# Altium schematic sheet TEMPLATE_Connectors.SchDoc
size Tabloid; SheetNumber: 3; SheetTotal: 5; Sheet_Name: Connecteurs; Size: 11x17
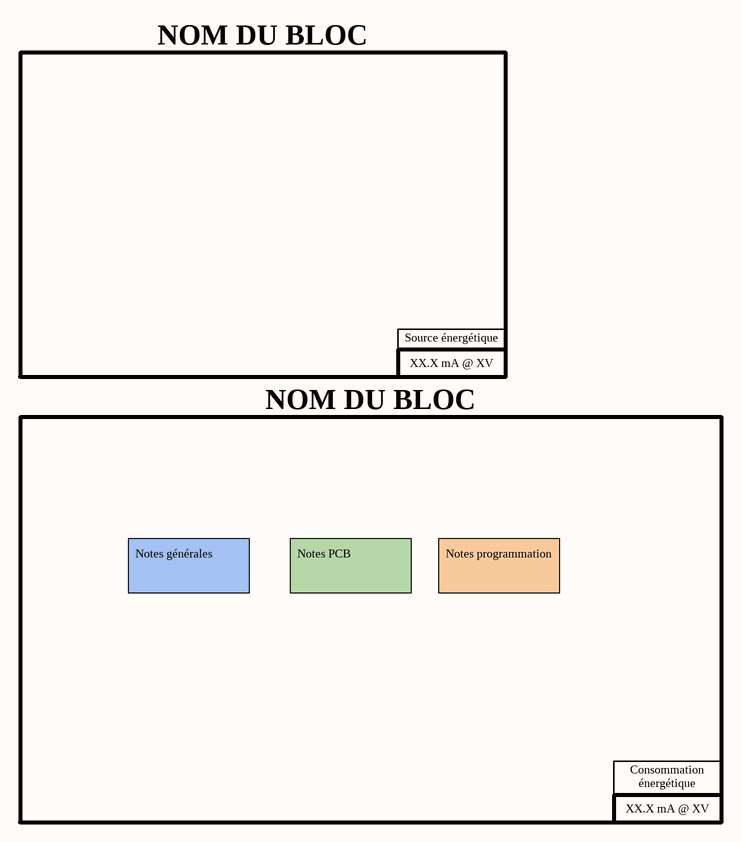
[diagram p0: TEMPLATE_Connectors.SchDoc]

## Notes on the sheet
- NOM DU BLOC
- Source énergétique
- XX.X mA @ XV
- Notes générales
- Notes PCB
- Notes programmation
- Consommation énergétique
- Nom de la feuille
- Titre du projet
- Cours associé au projet
- Taille
- Département
- Technologies du
- Révision
- PCB
- .
- SCH
- Date
- génie électrique
- Feuille
- Variant
- de
- Concepteurs